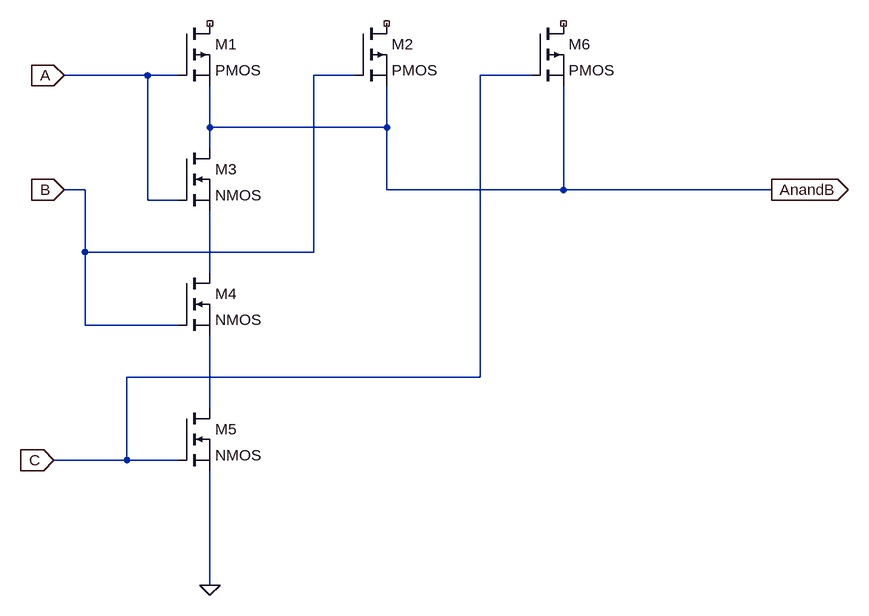
[diagram p0: schematic Draft2.asc]
Draft2.asc, the LTspice schematic file:
Version 4
SHEET 1 1192 932
WIRE 80 128 -48 128
WIRE 128 128 80 128
WIRE 400 128 336 128
WIRE 672 128 592 128
WIRE 176 208 176 144
WIRE 448 208 448 144
WIRE 448 208 176 208
WIRE 176 240 176 208
WIRE -16 304 -48 304
WIRE 448 304 448 208
WIRE 720 304 720 144
WIRE 720 304 448 304
WIRE 1040 304 720 304
WIRE 80 320 80 128
WIRE 128 320 80 320
WIRE -16 400 -16 304
WIRE 336 400 336 128
WIRE 336 400 -16 400
WIRE 176 432 176 336
WIRE -16 512 -16 400
WIRE 128 512 -16 512
WIRE 592 592 592 128
WIRE 592 592 48 592
WIRE 176 640 176 528
WIRE 48 720 48 592
WIRE 48 720 -64 720
WIRE 128 720 48 720
WIRE 176 912 176 736
FLAG 176 912 0
FLAG -48 128 A
IOPIN -48 128 In
FLAG -48 304 B
IOPIN -48 304 In
FLAG 1040 304 AnandB
IOPIN 1040 304 Out
FLAG -64 720 C
IOPIN -64 720 In
SYMBOL pmos 128 48 R0
SYMATTR InstName M1
SYMBOL pmos 400 48 R0
SYMATTR InstName M2
SYMBOL nmos 128 240 R0
SYMATTR InstName M3
SYMBOL nmos 128 432 R0
SYMATTR InstName M4
SYMBOL nmos 128 640 R0
SYMATTR InstName M5
SYMBOL pmos 672 48 R0
SYMATTR InstName M6

The netlist it stands for:
* Draft2.asc
M1 NC_01 A AnandB AnandB PMOS
M2 NC_02 B AnandB AnandB PMOS
M3 AnandB A N001 N001 NMOS
M4 N001 B N002 N002 NMOS
M5 N002 C 0 0 NMOS
M6 NC_03 C AnandB AnandB PMOS
.model NMOS NMOS
.model PMOS PMOS
.lib standard.mos
.backanno
.end